# Altium schematic sheet [6]Accumulator_Indicator.SchDoc
size A4; SheetNumber: 2; SheetTotal: 7
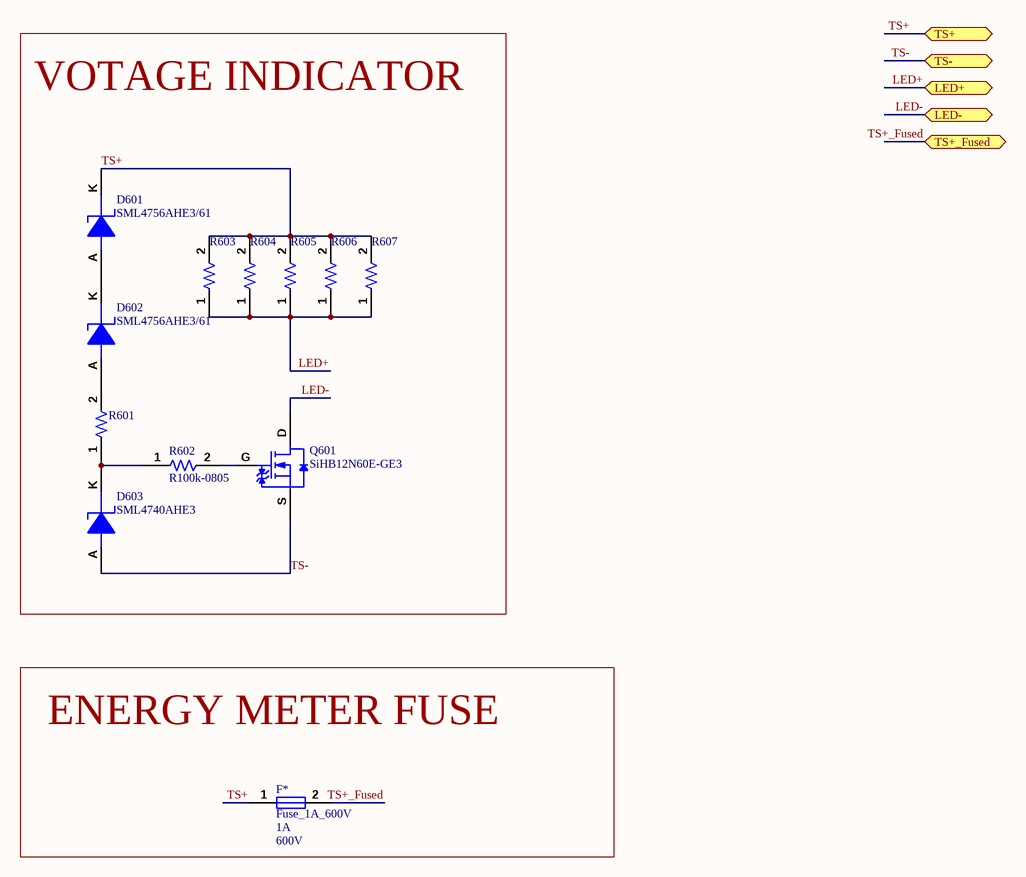
[diagram p0: [6]Accumulator_Indicator.SchDoc]

## Parts
?  (no value)  (graphical)
D601  SML4756AHE3/61  [DIOM4227X23N]
D602  SML4756AHE3/61  [DIOM4227X23N]
D603  SML4740AHE3  [DIOM4227X23N]
F*  Fuse_1A_600V  Current Rating: 1A  Voltage Rating (DC): 600V  [Fuse_485001]
Q601  SiHB12N60E-GE3  [SiHB12N60E-GE3-Footprint-1]
R601  PR03000201003JAC00  [PR03000202203JDC00-Footprint-1]  (value not drawn)
R602  R100k-0805  [RESC2013X70X40NL20T20]
R603  PR03000202203JDC00  [PR03000202203JDC00-Footprint-1]  (value not drawn)
R604  PR03000202203JDC00  [PR03000202203JDC00-Footprint-1]  (value not drawn)
R605  PR03000202203JDC00  [PR03000202203JDC00-Footprint-1]  (value not drawn)
R606  PR03000202203JDC00  [PR03000202203JDC00-Footprint-1]  (value not drawn)
R607  PR03000202203JDC00  [PR03000202203JDC00-Footprint-1]  (value not drawn)

## Blocks framed on the sheet
VOTAGE INDICATOR: D601-D603 Q601 R601-R607
ENERGY METER FUSE: F*

## Ports
LED+ (bidir, see Master_HV_PCB[1B]), LED- (bidir, see Master_HV_PCB[1B]), TS+ (bidir, see Master_HV_PCB[1B], [2]TSAL[4C], [3]HV_Detection[4B]), TS+_Fused (bidir, see Master_HV_PCB[1B]), TS- (bidir, see Master_HV_PCB[1B], [2]TSAL[4C], [3]HV_Detection[4B])

## Nets
LED+: R603.1 R604.1 R605.1 R606.1 R607.1 ; port LED+
LED-: Q601.D ; port LED-
TS+: D601.K F*.1 R603.2 R604.2 R605.2 R606.2 R607.2 ; port TS+
TS+_Fused: F*.2 ; port TS+_Fused
TS-: D603.A Q601.S ; port TS-
NetD601_A: D601.A D602.K
NetD602_A: D602.A R601.2
NetD603_K: D603.K R601.1 R602.1
NetQ601_G: Q601.G R602.2

## Notes on the sheet
- Size:
- Company:
- Project:
- Page Contents:
- Variant:
- Version:
- Checked by:
- Author:
- Sheet
- Date:
- Department:
- of

## Library data of the parts
? = CMP-00043-6: Standard Title Block
D601 D602 = CMP-004-00000-1: Zener Diode, 47V V(Z), 5%, 1W, Silicon, Unidirectional, DO-214AC; Pins: 2; Max Operating Temperature: 150°C; RoHS Compliant: Yes
D603 = CMP-00196-1: Zener Diode, 10V V(Z), 5%, 1W, Silicon, Unidirectional, DO-214AC; Reference Standard: AEC-Q101; Time @ Peak Reflow Temperature-Max (s): 10s; Package Body Material: Plastic; Number of Elements: 1; Test Current: 25mA; Dynamic Impedance-Max: 7R; JESD-30 Code: R-PDSO-C2; Terminal Finish: Tin; Moisture Sensitivity Level: 1; RoHS Compliant: Yes; Technology: ZENER; Surface Mount: Yes; Max Power Dissipation: 1W; Pins: 2; JESD-609 Code: e3; Voltage Tol-Max: 5%; Diode Type: ZENER; Package Shape: Rectangular; Peak Reflow Temperature (Cel): 260°C; Terminal Form: C BEND; Reach SVHC Compliant: Yes; Reference Voltage-Nom: 10V; Max Operating Temperature: 150°C; JEDEC-95 Code: DO-214AC; Terminal Position: DUAL; Package Style: SMALL OUTLINEMeter; Diode Element Material: SILICON; Polarity: Unidirectional
F* = CMP-00161-1: Surface Mount Fuses 600V 1A Fast Acting; Manufacturer Part Number 1: 0485001.DR; Manufacturer 1: Littelfuse; .Creator: DO; Voltage Rating (AC): 250V; Approvals: UL,CSA; Fuse Type: Board Mount (Cartridge Style Excluded); Resistance: 0.264; DC Cold Resistance: 304.4mR; Body Material: Ceramic; Max Operating Temperature: 125°C; Pricing 1: 1=2,82900, 5=2,81400, 10=2,75200, 50=2,59800, 100=2,40300, 250=2,37900, 500=2,30400, 1500=2,24900, 3000=2,11600 (USD); Min Operating Temperature: -55°C; ComponentLink5Description: http://www.littelfuse.com/~/media/Files/Littelfuse/Technical%20Resources/Documents/Data%20Sheets/Littelfuse_Fuse_485_Datasheet.pdf?src-supplier=Element14; Length: 12.1mm; Case/Package: SMD/SMT; Housing Material: Ceramic; REACH SVHC: No SVHC; Category: Fuses; Mount: Surface Mount; Lead Free: Lead Free; Voltage Rating: 600V; ComponentLink1URL: http://www.farnell.com/datasheets/1945989.pdf?src-supplier=Farnell; RoHS Compliant: Yes; Height: 0.177inch; Stock 1: 4123; Series: 485; ComponentLink6Description: http://www.littelfuse.com/~/media/electronics/datasheets/fuses/littelfuse_fuse_485_datasheet.pdf.pdf?src-supplier=Digi-Key; ComponentLink4Description: http://components.arrow.com/part/dataview/56707787S790276N3675?src-supplier=Arrow+Electronics; ComponentLink5URL: http://www.littelfuse.com/~/media/Files/Littelfuse/Technical%20Resources/Documents/Data%20Sheets/Littelfuse_Fuse_485_Datasheet.pdf?src-supplier=Element14; ComponentLink1Description: http://www.farnell.com/datasheets/1945989.pdf?src-supplier=Farnell; ComponentLink2URL: http://www.farnell.com/datasheets/2282568.pdf?src-supplier=Farnell; Termination: SMD/SMT; ComponentLink3URL: http://www.mouser.com/ds/2/240/Littelfuse485_datasheet_080512-201879.pdf?src-supplier=Mouser; Source: Filter components.SchLib; Depth: 4.5mm; Package Quantity: 1; ComponentLink3Description: http://www.mouser.com/ds/2/240/Littelfuse485_datasheet_080512-201879.pdf?src-supplier=Mouser; ComponentLink6URL: http://www.littelfuse.com/~/media/electronics/datasheets/fuses/littelfuse_fuse_485_datasheet.pdf.pdf?src-supplier=Digi-Key; RoHS: Yes; Design Item ID: Fuse_1A_600V; Fuse Current: 1A; Width: 0.177inch; ComponentLink2Description: http://www.farnell.com/datasheets/2282568.pdf?src-supplier=Farnell; Packaging: Tape and Reel; ComponentLink4URL: http://components.arrow.com/part/dataview/56707787S790276N3675?src-supplier=Arrow+Electronics
Q601 = CMP-013-00000-1: Power Field-Effect Transistor, 12A I(D), 600V, 0.38ohm, 1-Element, N-Channel, Silicon, Metal-oxide Semiconductor FET, TO-263AB; Max Operating Temperature: 150°C; RoHS Compliant: Yes; Pins: 2
R601 = CMP-009-00007-2: Fixed Resistor, Metal Film, 3W, 100000ohm, 750V, 5% +/-Tol, 250ppm/Cel, Through Hole Mount; Value: 100k; Pins: 2; Tolerance: 5%; Min Operating Temperature: -55°C; Power: 3W; Max Operating Temperature: 155°C; Mounting Technology: Through Hole; RoHS Compliant: Yes
R602 = CMP-009-00003-2: Fixed Resistor, Metal Glaze/thick Film, 0.125W, 100000ohm, 150V, 5% +/-Tol, 200ppm/Cel, Surface Mount, 0805; Value: 100k; Power: 125mW; Max Operating Temperature: 155°C; Mounting Technology: Surface Mount; RoHS Compliant: Yes; Min Operating Temperature: -55°C; Pins: 2; Case/Package: 0805; Tolerance: 5%
R603-R607 = CMP-009-00006-1: Fixed Resistor, Metal Film, 3W, 220000ohm, 750V, 5% +/-Tol, 250ppm/Cel, Through Hole Mount; RoHS Compliant: Yes